# EAGLE design Focuser (EAGLE 9.2.2)
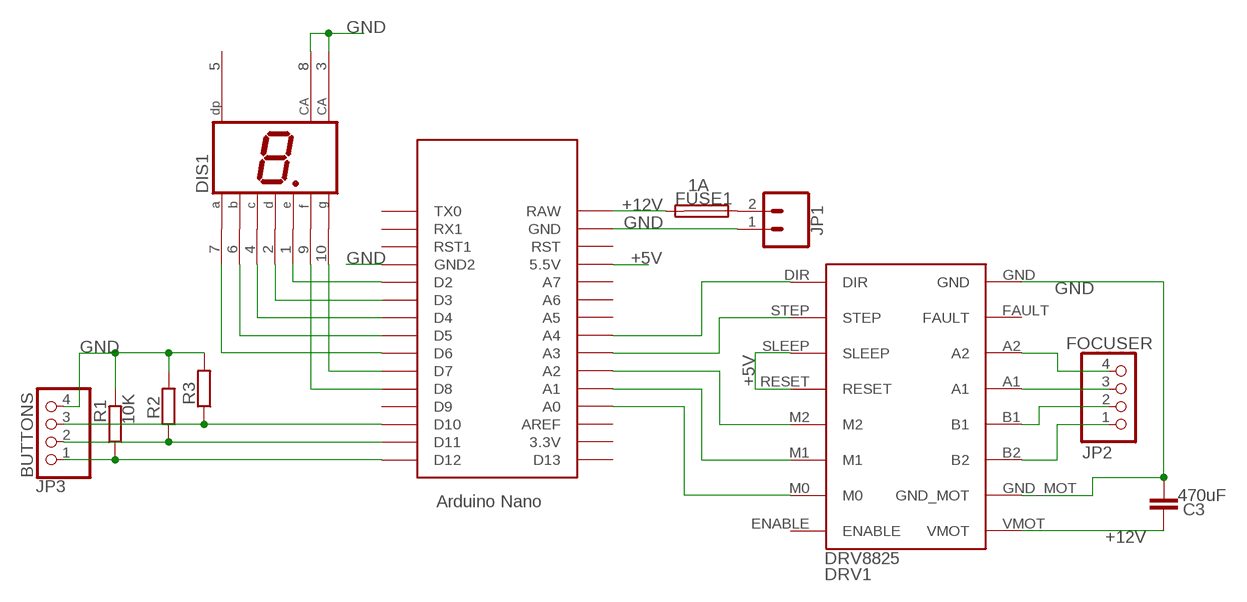
[diagram p0: schematic, sheet 1]

## Parts
C3  470uF  C5/2.5  [C5B2.5]
DIS1  HD-H101  [HDSP-M]
DRV1  DRV8825  [DRV8825]
FUSE1  1A  FUSEBLANK_5X20MM  [FUSE_HOLDER_5X20MM]
JP1  CONN_025MM  [SCREWTERMINAL-5MM-2]
JP2  FOCUSER  PINHD-1X4  [1X04]
JP3  BUTTONS  PINHD-1X4  [1X04]
R1  10K  R-EU_0204/2V  [0204V]
R2  10K  R-EU_0204/2V  [0204V]
R3  10K  R-EU_0204/2V  [0204V]
U$1  NANO  [NANO]

## Nets
+5V: DRV1.RESET DRV1.SLEEP U$1.5V(5.5V)
+12V: C3.2 DRV1.VMOT FUSE1.2 U$1.RAW
GND: C3.1 DIS1.3(CA) DIS1.8(CA) DRV1.GND DRV1.GND_MOT JP1.1 JP3.4 R1.2 R2.2 R3.2 U$1.GND U$1.GND1(GND2)
N$1: DIS1.1(E) U$1.D2
N$2: JP3.3 R3.1 U$1.D10
N$3: JP3.2 R2.1 U$1.D11
N$4: JP3.1 R1.1 U$1.D12
N$5: DRV1.DIR U$1.A4
N$6: DIS1.2(D) U$1.D3
N$7: FUSE1.1 JP1.2
N$8: DIS1.4(C) U$1.D4
N$9: DIS1.6(B) U$1.D5
N$10: DIS1.7(A) U$1.D6
N$11: DIS1.10(G) U$1.D7
N$12: DRV1.STEP U$1.A3
N$13: DRV1.B2 JP2.1
N$14: DRV1.B1 JP2.2
N$15: DRV1.A1 JP2.3
N$16: DRV1.A2 JP2.4
N$17: DRV1.M2 U$1.A2
N$18: DRV1.M1 U$1.A1
N$19: DIS1.9(F) U$1.D8
N$20: DRV1.M0 U$1.A0
Unconnected: DIS1.5(DP) DRV1.ENABLE DRV1.FAULT U$1.3.3V U$1.A5 U$1.A6 U$1.A7 U$1.AREF U$1.D9 U$1.D13 U$1.ICSP1 U$1.ICSP2 U$1.ICSP3 U$1.ICSP4 U$1.ICSP5 U$1.ICSP6 U$1.RST U$1.RST1 U$1.RX1 U$1.TX0

## Library data of the parts
C3 = capacitor-wima:C: CAPACITOR naming: grid - package width; SPICEPREFIX: C
DIS1 = display-hp:HD-H101: LED DISPLAY 1-character 7 segment, decimal point right; OC_FARNELL: unknown; OC_NEWARK: unknown; SPICEPREFIX: X
DRV1 = 1:DRV8825: DRV8825 Stepper motor driver; SPICEPREFIX: X
FUSE1 = fuse:FUSE: Fuse; OC_FARNELL: unknown; OC_NEWARK: unknown; SPICEPREFIX: F
JP1 = SparkFun-Connectors:CONN_02: Multi connection point. Often used as Generic Header-pin footprint for 0.1 inch spaced/style header connections On any of the 0.1 inch spaced packages, you can populate with these: Break Away Headers - Straight <https://www.sparkfun.com/products/116> (PRT-00116) Break Away Male Headers - Right Angle <https://www.sparkfun.com/products/553> (PRT-00553) Female Headers <https://www.sparkfun.com/products/115> (PRT-00115) Break Away Headers - Machine Pin <https://www.sparkfun.com/products/117> (PRT-00117) Break Away Female Headers - Swiss Machine Pin <https://www.sparkfun.com/products/743> (PRT-00743) For SCREWTERMINALS and SPRING TERMINALS visit here: Screw Terimnals on SparkFun.com <https://www.sparkfun.com/search/results?term=Screw+Terminals> (5mm/3.5mm/2.54mm spacing) This device is also useful as a general connection point to wire up your design to another part of your project. Our various solder wires solder well into these plated through hole pads. Hook-Up Wire - Assortment (Stranded, 22 AWG) <https://www.sparkfun.com/products/11375> (PRT-11375) Hook-Up Wire - Assortment (Solid Core, 22 AWG) <https://www.sparkfun.com/products/11367> (PRT-11367) View the entire wire category on our website here <https://www.sparkfun.com/categories/141> Special notes: Molex polarized connector foot print use with: PRT-08233 with associated crimp pins and housings. 2.54_SCREWTERM for use with PRT-10571. 3.5mm Screw Terminal footprints for PRT-08084 5mm Screw Terminal footprints for use with PRT-08432; SF_SKU: PRT-08432; SPICEPREFIX: B
JP2 JP3 = pinhead:PINHD-1X4: PIN HEADER; SPICEPREFIX: E
R1-R3 = resistor:R-EU_: RESISTOR, European symbol; SPICEPREFIX: R
U$1 = Arduino-clone:NANO: Arduino Nano; SPICEPREFIX: X

## Board
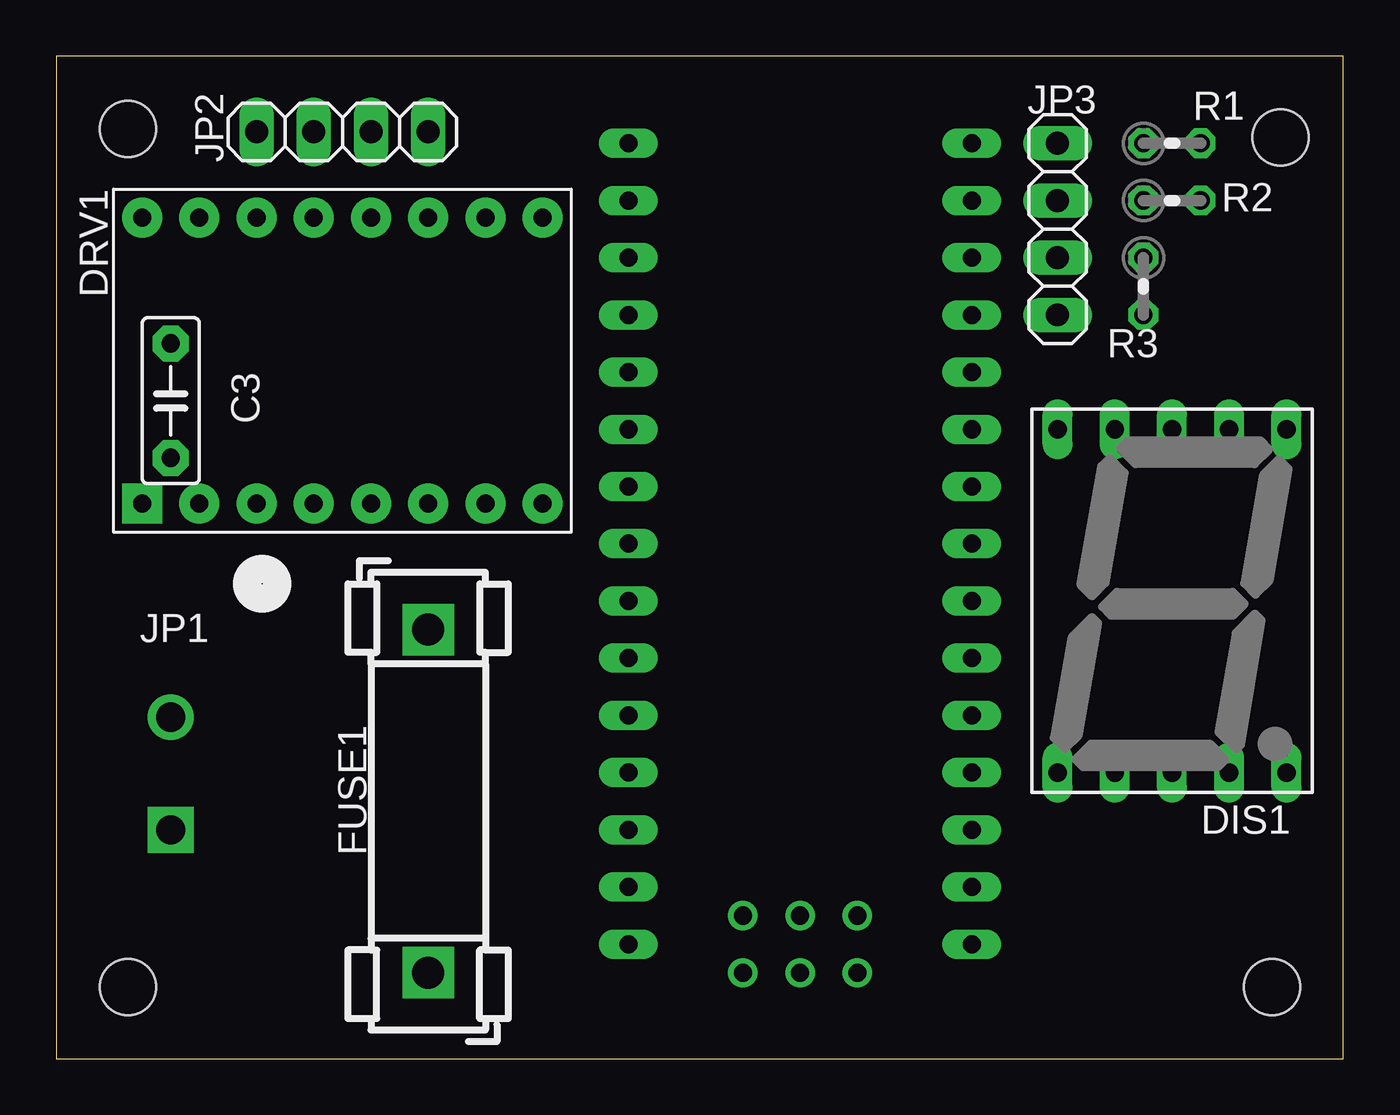
[diagram p1: board, top side]
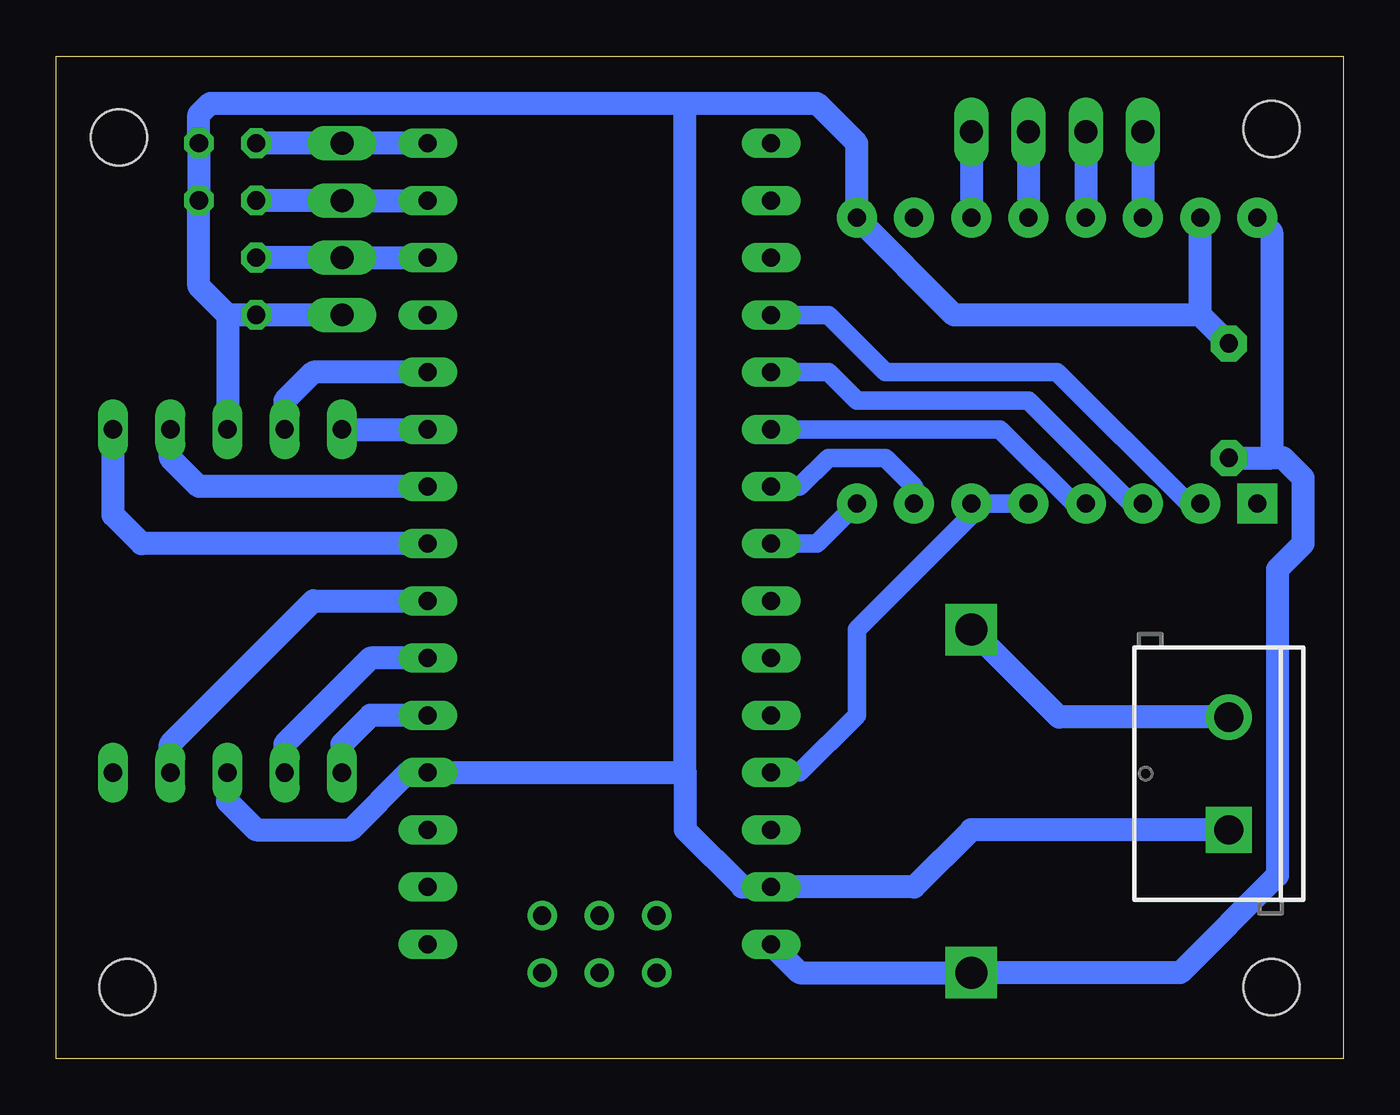
[diagram p2: board, bottom side, seen from below]

Size 57.13 x 44.5 mm. Coordinates in mm from the lower left corner, seen from the top.
Outline: 0,0 57.13,0 57.13,44.5 0,44.5 0,0
Copper layers (1*16): Top 0.035mm / dielectric 1.5mm / Bottom 0.035mm
Design rules "default": minimum track width 6mil, minimum drill 0.35mm, track to track 6mil, track to pad 6mil, pad to pad 6mil, via to via 6mil, smd to smd 6mil, copper to edge 40mil, drill to drill 6mil, minimum pad ring 10mil, minimum via ring 8mil, stop-mask expansion 4mil, vias tented up to drill 0mil, thermal gap 10mil
Holes 2.5 mm at 53.98,3.17 54.36,40.89 3.17,3.17 3.17,41.27

### Footprints (pad centres in the part's own frame; a part is rotated, then mirrored left to right if it is on the bottom)
C5B2.5 = drill 0.813 pad 1.6 octagon: 1 -2.54,0; 2 2.54,0
HDSP-M = drill 0.813 long: 1 -5.08,-7.62; 2 -2.54,-7.62; 3 0,-7.62; 4 2.54,-7.62; 5 5.08,-7.62; 6 5.08,7.62; 7 2.54,7.62; 8 0,7.62; 9 -2.54,7.62; 10 -5.08,7.62
DRV8825 = drill 0.8 pad 1.778: A1 13.97,-11.43; A2 13.97,-13.97; B1 13.97,-8.89; B2 13.97,-6.35; DIR 1.27,-19.05; FAULT 13.97,-16.51; GND 13.97,-19.05; GND_MOT 13.97,-3.81; M0 1.27,-3.81; M1 1.27,-6.35; M2 1.27,-8.89; RESET 1.27,-11.43; SLEEP 1.27,-13.97; STEP 1.27,-16.51; VMOT 13.97,-1.27 | drill 0.8 pad 1.778 square: ENABLE 1.27,-1.27
FUSE_HOLDER_5X20MM = drill 1.422 pad 2.286 square: 1 0,0; 2 15.24,0
SCREWTERMINAL-5MM-2 = drill 1.3 pad 2.032 square: 1 0,0 | drill 1.3 pad 2.032: 2 5,0
1X04 = drill 1.016 long: 1 -3.81,0; 2 -1.27,0; 3 1.27,0; 4 3.81,0
0204V = drill 0.813 octagon: 1 -1.27,0; 2 1.27,0
NANO = drill 0.8 long: 3.3V -10.16,24.13; 5V -10.16,-1.27; A0 -10.16,19.05; A1 -10.16,16.51; A2 -10.16,13.97; A3 -10.16,11.43; A4 -10.16,8.89; A5 -10.16,6.35; A6 -10.16,3.81; A7 -10.16,1.27; AREF -10.16,21.59; D2 5.08,1.27; D3 5.08,3.81; D4 5.08,6.35; D5 5.08,8.89; D6 5.08,11.43; D7 5.08,13.97; D8 5.08,16.51; D9 5.08,19.05; D10 5.08,21.59; D11 5.08,24.13; D12 5.08,26.67; D13 -10.16,26.67; GND -10.16,-6.35; GND1 5.08,-1.27; RAW -10.16,-8.89; RST -10.16,-3.81; RST1 5.08,-3.81; RX1 5.08,-6.35; TX0 5.08,-8.89 | drill 0.8: ICSP1 -5.08,-10.16; ICSP2 -5.08,-7.62; ICSP3 -2.54,-10.16; ICSP4 -2.54,-7.62; ICSP5 0,-10.16; ICSP6 0,-7.62

### Placement (x,y rotation side)
C3  5.08,29.21 270 top
DIS1  49.53,20.32 0 top
DRV1  2.54,23.37 90 top
FUSE1  16.51,19.05 270 top
JP1  5.08,10.16 90 bottom
JP2  12.7,41.15 0 top
JP3  44.45,36.83 270 top
R1  49.53,40.64 0 top
R2  49.53,38.1 0 top
R3  48.26,34.29 270 top
U$1  35.56,13.97 0 top

### Tracks (layer width: path | path; a pad name or v marks a point on that pad's centre or on a via)
+5V
  Bottom 0.813: DRV1.RESET DRV1.SLEEP 16.51,24.13 21.59,19.05 21.59,15.24 24.13,12.7 U$1.5V
+12V
  Bottom 1.016: DRV1.VMOT 3.17,36.7 3.17,26.67 | C3.2 3.17,26.67 | 3.17,26.67 2.67,26.67 1.78,25.78 1.78,22.86 2.92,21.72 2.92,8.13 7.24,3.81 FUSE1.2 24.13,3.81 U$1.RAW
GND
  Bottom 1.016: C3.1 6.35,33.02 | 6.35,33.02 DRV1.GND_MOT | 6.35,33.02 17.27,33.02 DRV1.GND 21.59,40.64 23.37,42.42 29.21,42.42 | JP1.1 16.51,10.16 19.05,7.62 U$1.GND 26.67,7.62 29.21,10.16 29.21,12.7 | JP3.4 R3.2 49.53,33.02 | 49.53,33.02 50.8,34.29 R2.2 R1.2 50.8,41.91 50.29,42.42 29.21,42.42 | DIS1.3 49.53,11.43 48.26,10.16 44.07,10.16 41.53,12.7 U$1.GND1 29.21,12.7 | 49.53,33.02 DIS1.8 | 29.21,12.7 29.21,42.42
N$1
  Bottom 1.016: DIS1.1 44.45,13.97 43.18,15.24 U$1.D2
N$2
  Bottom 1.016: U$1.D10 JP3.3 R3.1
N$3
  Bottom 1.016: U$1.D11 JP3.2 R2.1
N$4
  Bottom 1.016: U$1.D12 JP3.1 R1.1
N$5
  Bottom 0.813: DRV1.DIR 23.37,22.86 U$1.A4
N$6
  Bottom 1.016: U$1.D3 43.18,17.78 46.99,13.97 DIS1.2
N$7
  Bottom 1.016: JP1.2 12.62,15.16 FUSE1.1
N$8
  Bottom 1.016: DIS1.4 52.07,13.97 45.72,20.32 U$1.D4
N$9
  Bottom 1.016: U$1.D5 53.34,22.86 54.61,24.13 DIS1.6
N$10
  Bottom 1.016: U$1.D6 50.8,25.4 52.07,26.67 DIS1.7
N$11
  Bottom 1.016: DIS1.10 U$1.D7
N$12
  Bottom 0.813: 19.56,24.64 DRV1.STEP 19.05,25.4 20.32,26.67 22.86,26.67 24.13,25.4 U$1.A3
N$13
  Bottom 1.016: JP2.1 DRV1.B2
N$14
  Bottom 1.016: JP2.2 DRV1.B1
N$15
  Bottom 1.016: JP2.3 DRV1.A1
N$16
  Bottom 1.016: JP2.4 DRV1.A2
N$17
  Bottom 0.813: U$1.A2 15.24,27.94 11.94,24.64 DRV1.M2
N$18
  Bottom 0.813: DRV1.M1 9.4,24.64 13.97,29.21 21.59,29.21 22.86,30.48 U$1.A1
N$19
  Bottom 1.016: U$1.D8 45.72,30.48 46.99,29.21 DIS1.9
N$20
  Bottom 0.813: U$1.A0 22.86,33.02 20.32,30.48 12.7,30.48 6.86,24.64 DRV1.M0